# Altium schematic sheet OSC&RESET.SchDoc
size A4
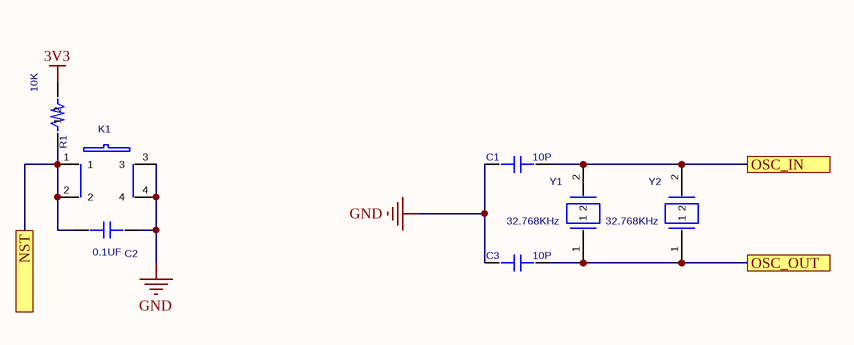
[diagram p0: OSC&RESET.SchDoc]

## Parts
C1  value 10P  [RES_0603_FIRE]  (hidden comment: CAP_10P_0603_FIRE)
C2  value 0.1UF  [CAP_0603_FIRE]  (hidden comment: CAP_0.1UF_0603_FIRE)
C3  value 10P  [RES_0603_FIRE]  (hidden comment: CAP_10P_0603_FIRE)
K1  KEY  [SW6.2/6.2-SMD]  (value not drawn)
R1  value 10K  [RES_0603_FIRE]  (hidden comment: RES_10K_0603_FIRE)
Y1  value 32.768KHz  [3215]  (hidden comment: XTAL_32.768KHZ_3215)
Y2  value 32.768KHz  [3215]  (hidden comment: XTAL_32.768KHZ_3215)

## Ports
NST, OSC_IN, OSC_OUT

## Nets
3V3: R1.2
GND: C1.1 C2.1 C3.1 K1.3 K1.4
NST: C2.2 K1.1 K1.2 R1.1 ; port NST
OSC_IN: C1.2 Y1.2 Y2.2 ; port OSC_IN
OSC_OUT: C3.2 Y1.1 Y2.1 ; port OSC_OUT

## Library data of the parts
C1 C3 = CAP_10P_0603_FIRE: 0603; Manufacture 1: SUPERCAP; Tolerance: +-5%; PCB DECAL: RES_0603_FIRE
C2 = CAP_0.1UF_0603_FIRE: SURFACE MOUNT CAPACITOR 0.031 X 0.061 INCHES; PCB DECAL: CAP_0603_FIRE
R1 = RES_10K_0603_FIRE: SURFACE MOUNT RESISTOR 0.031 X 0.061 INCHES, 1/10W; Assembly: SMD; PCB DECAL: RES_0603_FIRE
Y1 Y2 = XTAL_32.768KHZ_3215: CRYSTAL; PCB DECAL: 3215
K1 = KEY: Manufacturer #1 PN: KEY; PCB DECAL: SW6.2/6.2-SMD